# EAGLE design envsensor (EAGLE 4.92)
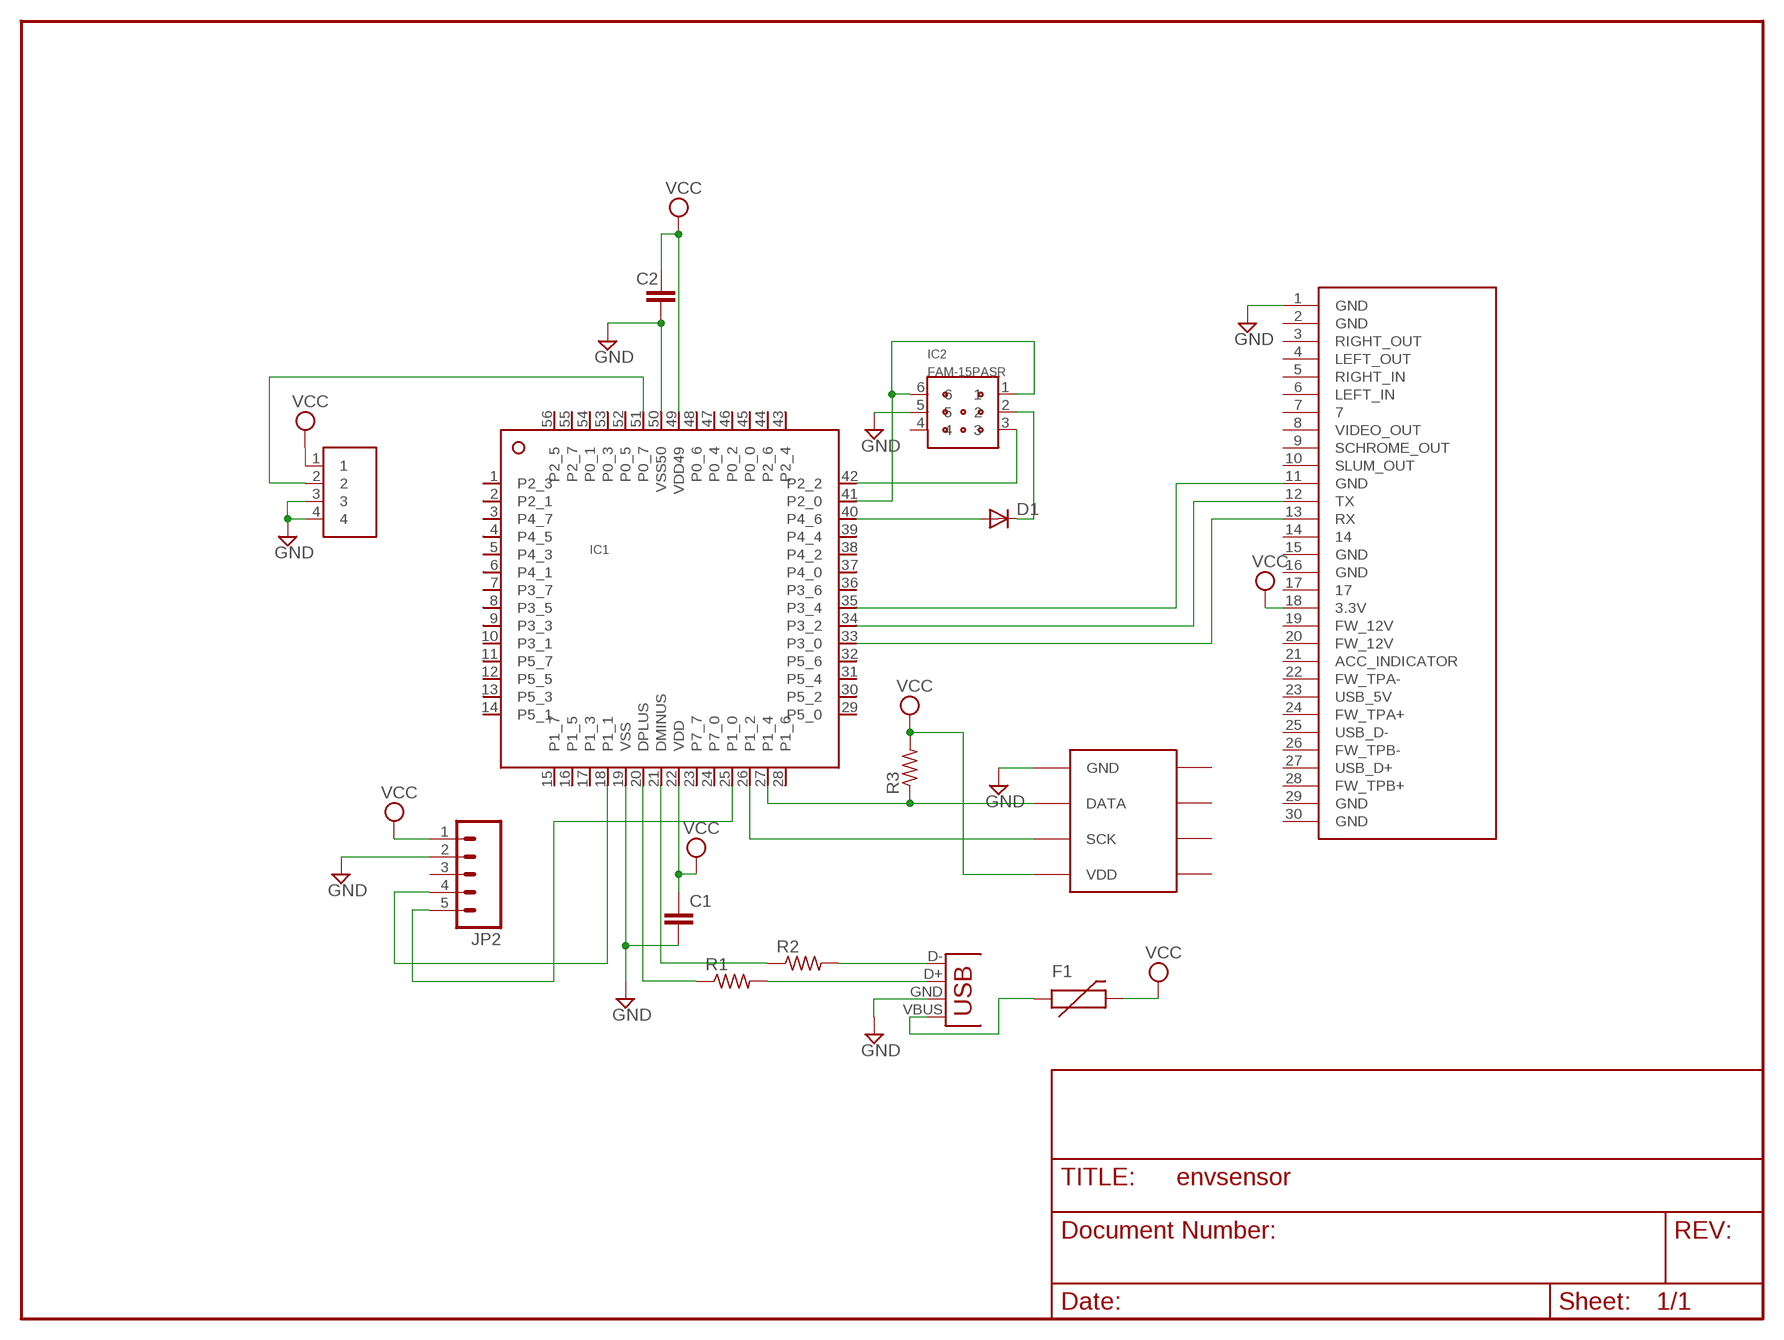
[diagram p0: schematic, sheet 1]

## Parts
C1  C-EUC2012  [C2012]
C2  C-EUC2012  [C2012]
D1  1N4148  [DO35-10]
F1  PS-SMD  [C3225]
IC1  CY8C24794-24LFXI  [QFN56]
IC2  FAM-15PASR  [FAM-15PASR]
JP2  M05  [1X05]
R1  R-US_M0805  [M0805]
R2  R-US_M0805  [M0805]
R3  R-US_M0805  [M0805]
SHT1  SHT11  [SHT11]
TGS4161  TGS4161  [TGS4161]
U$1  IPOD_CONNECTOR_MALE  [IPOD_MALE_CONNECTOR]
X2  USB-A-H  [USB-A-H]

## Nets
GND [Power]: C1.2 C2.2 IC1.19(VSS) IC1.50(VSS50) IC2.5 JP2.2 SHT1.GND TGS4161.3 TGS4161.4 U$1.1(GND) X2.GND(VBUS)
N$1: R2.2 X2.D-(D+)
N$2: IC1.20(DPLUS) R1.1
N$3: R1.2 X2.D+(D-)
N$4: IC1.21(DMINUS) R2.1
N$5: IC1.27(P1_4) R3.1 SHT1.DATA
N$6: IC1.25(P1_0) JP2.5
N$7: IC1.41(P2_0) IC2.1 IC2.6
N$8: IC1.42(P2_2) IC2.3
N$9: D1.C IC2.2
N$10: D1.A IC1.40(P4_6)
N$11: IC1.51(P0_7) TGS4161.2
N$12: IC1.18(P1_1) JP2.4
N$13: F1.1 X2.VBUS(GND)
N$14: IC1.26(P1_2) SHT1.SCK
N$15: IC1.33(P3_0) U$1.13(RX)
N$16: IC1.34(P3_2) U$1.12(TX)
N$17: IC1.35(P3_4) U$1.11(GND)
VCC: C1.1 C2.1 F1.2 IC1.22(VDD) IC1.49(VDD49) JP2.1 R3.2 SHT1.VDD TGS4161.1 U$1.18(3.3V)
Unconnected: IC1.1(P2_3) IC1.2(P2_1) IC1.3(P4_7) IC1.4(P4_5) IC1.5(P4_3) IC1.6(P4_1) IC1.7(P3_7) IC1.8(P3_5) IC1.9(P3_3) IC1.10(P3_1) IC1.11(P5_7) IC1.12(P5_5) IC1.13(P5_3) IC1.14(P5_1) IC1.15(P1_7) IC1.16(P1_5) IC1.17(P1_3) IC1.23(P7_7) IC1.24(P7_0) IC1.28(P1_6) IC1.29(P5_0) IC1.30(P5_2) IC1.31(P5_4) IC1.32(P5_6) IC1.36(P3_6) IC1.37(P4_0) IC1.38(P4_2) IC1.39(P4_4) IC1.43(P2_4) IC1.44(P2_6) IC1.45(P0_0) IC1.46(P0_2) IC1.47(P0_4) IC1.48(P0_6) IC1.52(P0_5) IC1.53(P0_3) IC1.54(P0_1) IC1.55(P2_7) IC1.56(P2_5) IC2.4 JP2.3 SHT1.5 SHT1.6 SHT1.7 SHT1.8 U$1.2(GND) U$1.3(RIGHT_OUT) U$1.4(LEFT_OUT) U$1.5(RIGHT_IN) U$1.6(LEFT_IN) U$1.7 U$1.8(VIDEO_OUT) U$1.9(SCHROME_OUT) U$1.10(SLUM_OUT) U$1.14 U$1.15(GND) U$1.16(GND) U$1.17 U$1.19(FW_12V) U$1.20(FW_12V) U$1.21(ACC_INDICATOR) U$1.22(FW_TPA-) U$1.23(USB_5V) U$1.24(FW_TPA+) U$1.25(USB_D-) U$1.26(FW_TPB-) U$1.27(USB_D+) U$1.28(FW_TPB+) U$1.29(GND) U$1.30(GND)

## Library data of the parts
C1 C2 = rcl:C-EU: CAPACITOR, European symbol
D1 = diode:1N4148: DIODE high speed (Philips)
F1 = envsensor:PS-SMD
IC1 = envsensor:CY8C24794-24LFXI
IC2 = envsensor:FAM-15PASR
JP2 = SparkFun:M05: Header 5 Standard 5-pin 0.1" header. Use with straight break away headers (SKU : PRT-00116), right angle break away headers (PRT-00553), swiss pins (PRT-00743), machine pins (PRT-00117), and female headers (PRT-00115). Molex polarized connector foot print use with SKU : PRT-08230 with associated crimp pins and housings.
R1-R3 = rcl:R-US_: RESISTOR, American symbol
SHT1 = envsensor:SHT11
TGS4161 = envsensor:TGS4161
U$1 = SparkFun:IPOD_CONNECTOR_MALE: iPod Male Connector This is the connector that will insert into an iPods. Use this connector to gain access to the various iPod pins. Schematic and footprint are not yet production proven. The PCB thickness must be more thin than the standard 0.062" FR4. Spark Fun Electronics SKU : DEV-00633
X2 = SparkFun:USB: USB Connectors USB-B-PTH is fully proven SKU : PRT-00139 USB-miniB is fully proven SKU : PRT-00587 USB-A-PCB is untested. USB-A-H is throughly reviewed, but untested. Spark Fun Electronics SKU : PRT-00437 USB-B-SMT is throughly reviewed, but untested. Needs silkscreen touching up. USB-A-S has not been used/tested USB-MB-H has not been used/tested

## Net classes
1 Power: clearance 0.152 mm

## Board
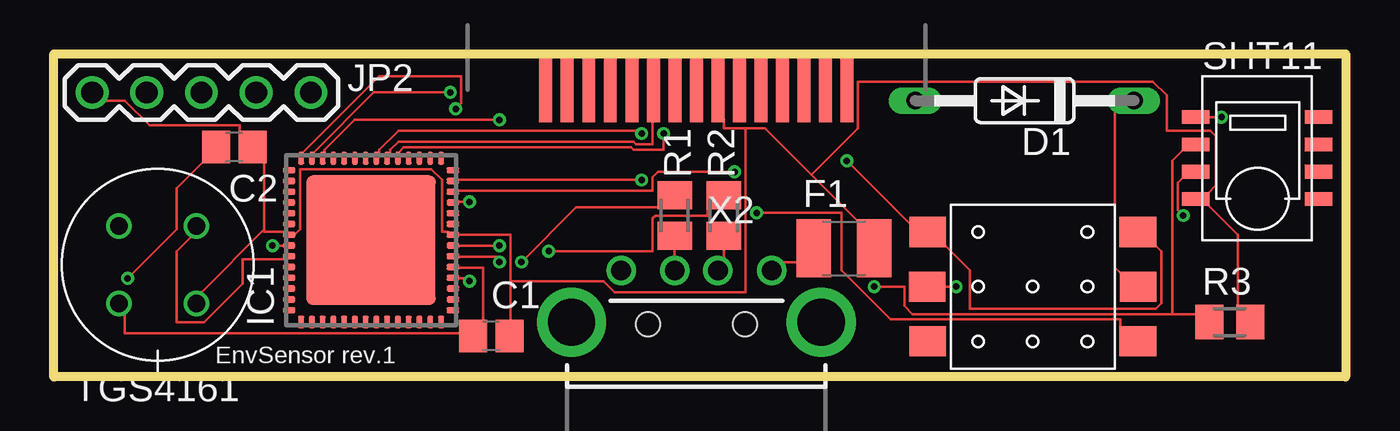
[diagram p1: board, top side]
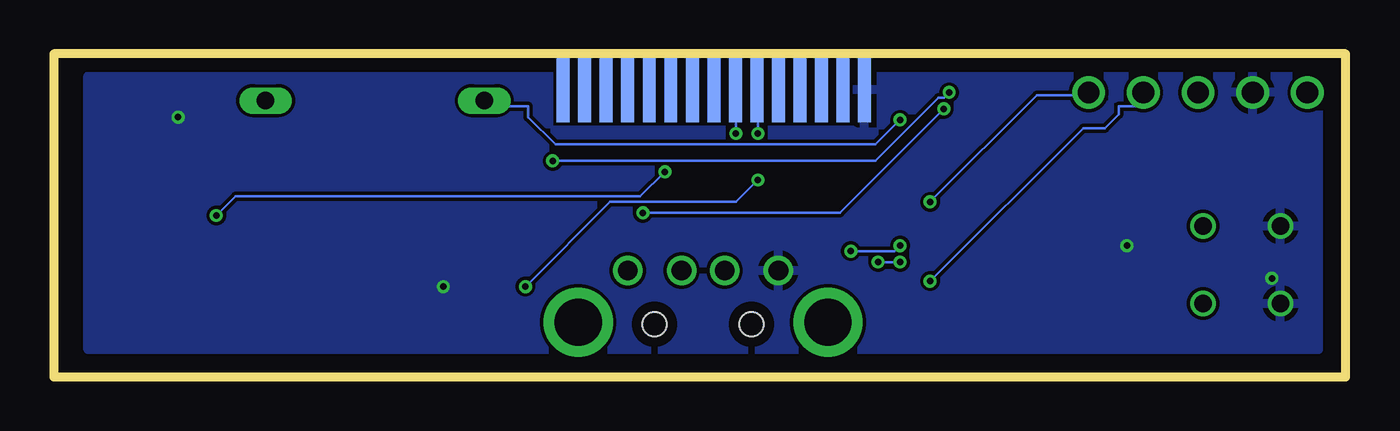
[diagram p2: board, bottom side, seen from below]

Size 60 x 15 mm. Coordinates in mm from the lower left corner, seen from the top.
Outline: 0,0 0,15 60,15 60,0 0,0
Copper layers (1*16): Top 0.035mm / dielectric 1.5mm / Bottom 0.035mm
Design rules "p_ban_2layer": minimum track width 5mil, minimum drill 0.3mm, track to track 5mil, track to pad 5mil, pad to pad 5mil, via to via 5mil, smd to smd 5mil, copper to edge 0.5mm, drill to drill 0.3mm, minimum pad ring 0.15mm, minimum via ring 0.15mm, stop-mask expansion 4mil, vias tented up to drill 0.35mm, thermal gap 10mil

### Footprints (pad centres in the part's own frame; a part is rotated, then mirrored left to right if it is on the bottom)
C2012 = smd 1.3 x 1.5: 1 -0.85,0; 2 0.85,0
DO35-10 = drill 0.813 long: A 5.08,0; C -5.08,0
C3225 = smd 1.6 x 2.7: 1 -1.4,0; 2 1.4,0
QFN56 = smd 0.6 x 0.3: 1 -3.8,3.25; 2 -3.8,2.75; 3 -3.8,2.25; 4 -3.8,1.75; 5 -3.8,1.25; 6 -3.8,0.75; 7 -3.8,0.25; 8 -3.8,-0.25; 9 -3.8,-0.75; 10 -3.8,-1.25; 11 -3.8,-1.75; 12 -3.8,-2.25; 13 -3.8,-2.75; 14 -3.8,-3.25; 29 3.8,-3.25; 30 3.8,-2.75; 31 3.8,-2.25; 32 3.8,-1.75; 33 3.8,-1.25; 34 3.8,-0.75; 35 3.8,-0.25; 36 3.8,0.25; 37 3.8,0.75; 38 3.8,1.25; 39 3.8,1.75; 40 3.8,2.25; 41 3.8,2.75; 42 3.8,3.25 | smd 0.3 x 0.6: 15 -3.25,-3.8; 16 -2.75,-3.8; 17 -2.25,-3.8; 18 -1.75,-3.8; 19 -1.25,-3.8; 20 -0.75,-3.8; 21 -0.25,-3.8; 22 0.25,-3.8; 23 0.75,-3.8; 24 1.25,-3.8; 25 1.75,-3.8; 26 2.25,-3.8; 27 2.75,-3.8; 28 3.25,-3.8; 43 3.25,3.8; 44 2.75,3.8; 45 2.25,3.8; 46 1.75,3.8; 47 1.25,3.8; 48 0.75,3.8; 49 0.25,3.8; 50 -0.25,3.8; 51 -0.75,3.8; 52 -1.25,3.8; 53 -1.75,3.8; 54 -2.25,3.8; 55 -2.75,3.8; 56 -3.25,3.8 | smd 6 x 6: EPAD 0,0
FAM-15PASR = smd 1.7 x 1.4: 1 4.88,2.54; 2 4.9,0; 3 4.88,-2.54; 4 -4.88,-2.54; 5 -4.9,0; 6 -4.88,2.54
1X05 = drill 1.016 round: 1 0,0; 2 2.54,0; 3 5.08,0; 4 7.62,0; 5 10.16,0
M0805 = smd 1.3 x 1.6: 1 -0.95,0; 2 0.95,0
SHT11 = smd 1.27 x 0.635: 5 7.31,2.54; 6 7.31,3.81; 7 7.31,5.08; 8 7.31,6.35; DATA 1.59,5.08; GND 1.59,6.35; SCK 1.59,3.81; VDD 1.59,2.54
TGS4161 = drill 0.8 round: 1 -1.8,1.8; 2 -1.8,-1.8; 3 1.8,-1.8; 4 1.8,1.8
IPOD_MALE_CONNECTOR = smd 0.6 x 3 bottom: 1 -7.5,0; 3 -6.5,0; 5 -5.5,0; 7 -4.5,0; 9 -3.5,0; 11 -2.5,0; 13 -1.5,0; 15 -0.5,0; 17 0.5,0; 19 1.5,0; 21 2.5,0; 23 3.5,0; 25 4.5,0; 27 5.5,0; 29 6.5,0 | smd 0.6 x 3: 2 -7,0; 4 -6,0; 6 -5,0; 8 -4,0; 10 -3,0; 12 -2,0; 14 -1,0; 16 0,0; 18 1,0; 20 2,0; 22 3,0; 24 4,0; 26 5,0; 28 6,0; 30 7,0
USB-A-H = drill 0.914 round: D+ 2.4,1; D- 2.4,-1; GND 2.4,3.5; VBUS 2.4,-3.5 | drill 2.2 round: GND@1 0,5.8; GND@2 0,-5.8 | hole 1.1: -0.1,2.25; -0.1,-2.25

### Placement (x,y rotation side)
C1  20.32,1.91 180 top
C2  8.38,10.67 180 top
D1  45.09,12.83 180 top
F1  36.7,5.97 0 top
IC1  14.73,6.35 90 top
IC2  45.47,4.19 0 top
JP2  1.78,13.21 0 top
R1  28.83,7.49 270 top
R2  31.11,7.49 270 top
R3  54.61,2.54 0 top
SHT1  51.44,5.71 0 top
TGS4161  4.83,5.21 180 top
U$1  29.84,13.34 0 top
X2  29.84,2.54 90 top

### Tracks (layer width: path | path; a pad name or v marks a point on that pad's centre or on a via)
GND  (via drill 0.3)
  Top 0.127: IC1.19 18.8,5.08 19.94,5.08 19.94,2.54 C1.2 18.92,2.03 3.3,2.03 3.3,2.92 TGS4161.4 | v10.16,6.1 10.67,6.1 IC1.50 | v3.43,4.57 5.71,6.86 5.71,8.76 6.99,10.03 C2.2 | SHT1.GND v54.23,12.06 | IC2.5 v41.91,4.19
  pour Bottom: 1.27,13.97 1.27,1.27 58.42,1.27 58.42,13.97
N$1
  Top 0.127: R2.2 31.11,5.59 X2.D-
N$2  (via drill 0.3)
  Top 0.127: v20.7,5.33 20.7,5.59 18.8,5.59 IC1.20 | v21.72,5.33 24.26,7.87 28.07,7.87 R1.1
  Bottom 0.127: v20.7,5.33 v21.72,5.33
N$3
  Top 0.127: R1.2 28.83,5.59 X2.D+
N$4  (via drill 0.3)
  Top 0.127: v20.7,6.1 18.8,6.1 IC1.21 | v22.99,5.84 27.81,5.84 27.81,7.37 27.94,7.49 30.35,7.49 30.35,7.87 R2.1
  Bottom 0.127: v20.7,6.1 20.95,5.84 v22.99,5.84
N$5  (via drill 0.3)
  Top 0.127: v27.3,9.14 18.8,9.14 IC1.27 | v38.1,4.19 39.5,4.19 39.5,3.3 39.88,2.92 51.94,2.92 | 51.94,2.92 53.09,2.92 R3.1 | 51.94,2.92 51.94,10.03 52.45,10.54 SHT1.DATA
  Bottom 0.127: v27.3,9.14 28.32,8.13 34.16,8.13 v38.1,4.19
N$6  (via drill 0.3)
  Top 0.127: v19.3,8.13 18.8,8.13 IC1.25
  Bottom 0.127: v19.3,8.13 14.35,13.08 12.57,13.08 JP2.5
N$7  (via drill 0.3)
  Top 0.127: v18.41,13.21 14.86,13.21 12.06,10.41 IC1.41 | v36.83,10.03 39.75,7.11 IC2.6 41.4,6.1 42.55,4.95 42.55,3.17 51.18,3.17 51.44,3.43 51.44,5.84 51.18,6.1 IC2.1
  Bottom 0.127: v18.41,13.21 18.67,12.95 18.92,12.95 21.84,10.03 v36.83,10.03
N$8  (via drill 0.3)
  Top 0.127: v18.67,12.45 18.92,12.7 18.92,13.97 15.11,13.97 11.56,10.41 IC1.42 | v32.64,7.62 36.58,7.62 36.58,4.95 38.86,2.67 49.53,2.67 49.53,2.29 IC2.3
  Bottom 0.127: v18.67,12.45 23.5,7.62 v32.64,7.62
N$9
  Top 0.127: IC2.2 49.53,4.83 49.28,5.08 49.28,12.32 D1.C
N$10  (via drill 0.3)
  Top 0.127: v20.7,11.94 13.97,11.94 12.57,10.54 12.57,10.41 IC1.40
  Bottom 0.127: v20.7,11.94 21.84,10.79 36.7,10.79 37.97,12.06 37.97,12.57 38.86,12.57 D1.A
N$11
  Top 0.127: IC1.51 10.67,5.46 8.76,5.46 8.76,4.32 6.99,2.54 5.71,2.54 5.71,5.84 6.35,6.48 TGS4161.2
N$12  (via drill 0.3)
  Top 0.127: v19.3,4.45 19.3,4.57 18.8,4.57 IC1.18
  Bottom 0.127: v19.3,4.45 12.19,11.56 11.18,11.56 10.54,12.19 10.54,12.57 9.78,12.57 JP2.4
N$13
  Top 0.127: F1.1 34.54,5.33 33.91,5.33 X2.VBUS
N$14  (via drill 0.3)
  Top 0.127: v31.62,9.53 28.07,9.53 27.81,9.27 27.81,8.64 18.8,8.64 IC1.26 | v52.45,7.49 52.2,7.75 52.2,9.02 52.45,9.27 SHT1.SCK
  Bottom 0.127: v31.62,9.53 32.77,8.38 51.56,8.38 v52.45,7.49
N$15  (via drill 0.3)
  Top 0.127: v28.32,11.3 28.32,10.54 26.92,10.54 26.8,10.67 16.26,10.67 16,10.41 IC1.33
  Bottom 0.127: v28.32,11.3 28.32,11.94 U$1.13
N$16
  Top 0.127: IC1.34 15.62,10.41 15.62,10.54 16,10.92 26.92,10.92 27.05,10.79 27.81,10.79 27.81,11.94 U$1.12
N$17  (via drill 0.3)
  Top 0.127: v27.3,11.3 27.3,11.43 16,11.43 15.11,10.54 15.11,10.41 IC1.35
  Bottom 0.127: v27.3,11.3 27.3,11.94 U$1.11
VCC
  Top 0.127: 21.21,4.45 21.21,2.54 C1.1 | 21.21,4.45 21.21,6.6 18.8,6.6 IC1.22 18.29,6.73 18.03,6.73 18.03,9.14 17.53,9.65 11.43,9.65 11.43,6.86 11.18,6.6 IC1.49 10.67,6.73 9.78,6.73 9.78,6.86 | 9.78,6.86 9.78,10.03 C2.1 8.64,11.3 8.64,11.68 4.45,11.68 3.3,12.83 2.41,12.83 JP2.1 | 9.78,6.86 6.86,3.94 TGS4161.1 | R3.2 54.99,3.3 54.99,6.6 53.59,8 SHT1.VDD 53.59,8.51 53.98,8.89 53.98,11.18 53.72,11.43 51.69,11.43 51.69,13.08 51.05,13.72 37.34,13.72 37.34,11.56 35.18,9.4 | 35.18,9.4 33.02,11.56 32.13,11.56 | 35.18,9.4 37.34,7.24 F1.2 | 32.13,11.56 31.11,11.56 31.11,11.94 U$1.18 | 21.21,4.45 25.53,4.45 26.04,3.94 32.13,3.94 32.13,11.56

### Text on the board
tPlace: EnvSensor rev.1